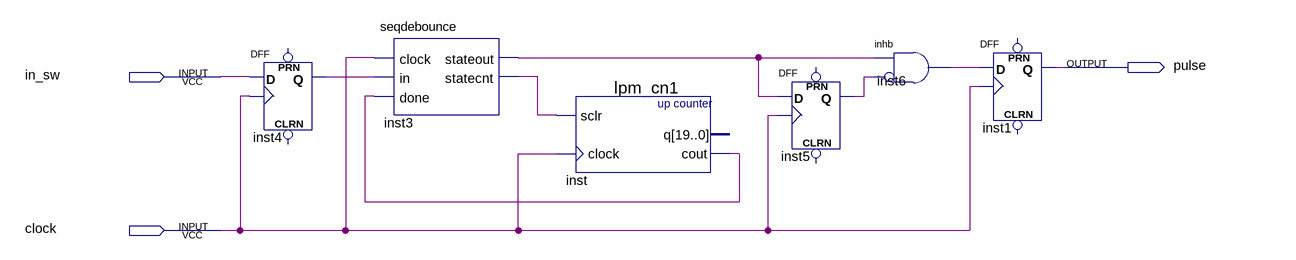
[diagram p0: schematic sheet]
// Quartus schematic SlowClock.bdf as structural Verilog: 6 symbols, 3 pins
module SlowClock (
  input  in_sw,
  input  clock,
  output pulse
);

  wire inst3_statecnt, inst3_stateout, inst4_q, inst5_q, inst6_1, inst_cout;

  DFF inst4 (.CLK(clock), .D(in_sw), .Q(inst4_q));  // open: CLRN, PRN
  seqdebounce inst3 (
    .clock(clock), .in(inst4_q), .done(inst_cout), .stateout(inst3_stateout), .statecnt(inst3_statecnt));
  lpm_cn1 inst (.sclr(inst3_statecnt), .clock(clock), .cout(inst_cout));  // open: q
  DFF inst5 (.CLK(clock), .D(inst3_stateout), .Q(inst5_q));  // open: CLRN, PRN
  inhb inst6 (.\2 (inst3_stateout), .\3 (inst5_q), .\1 (inst6_1));
  DFF inst1 (.CLK(clock), .D(inst6_1), .Q(pulse));  // open: CLRN, PRN
endmodule
